# EAGLE design Schematic (EAGLE 7.5.0)
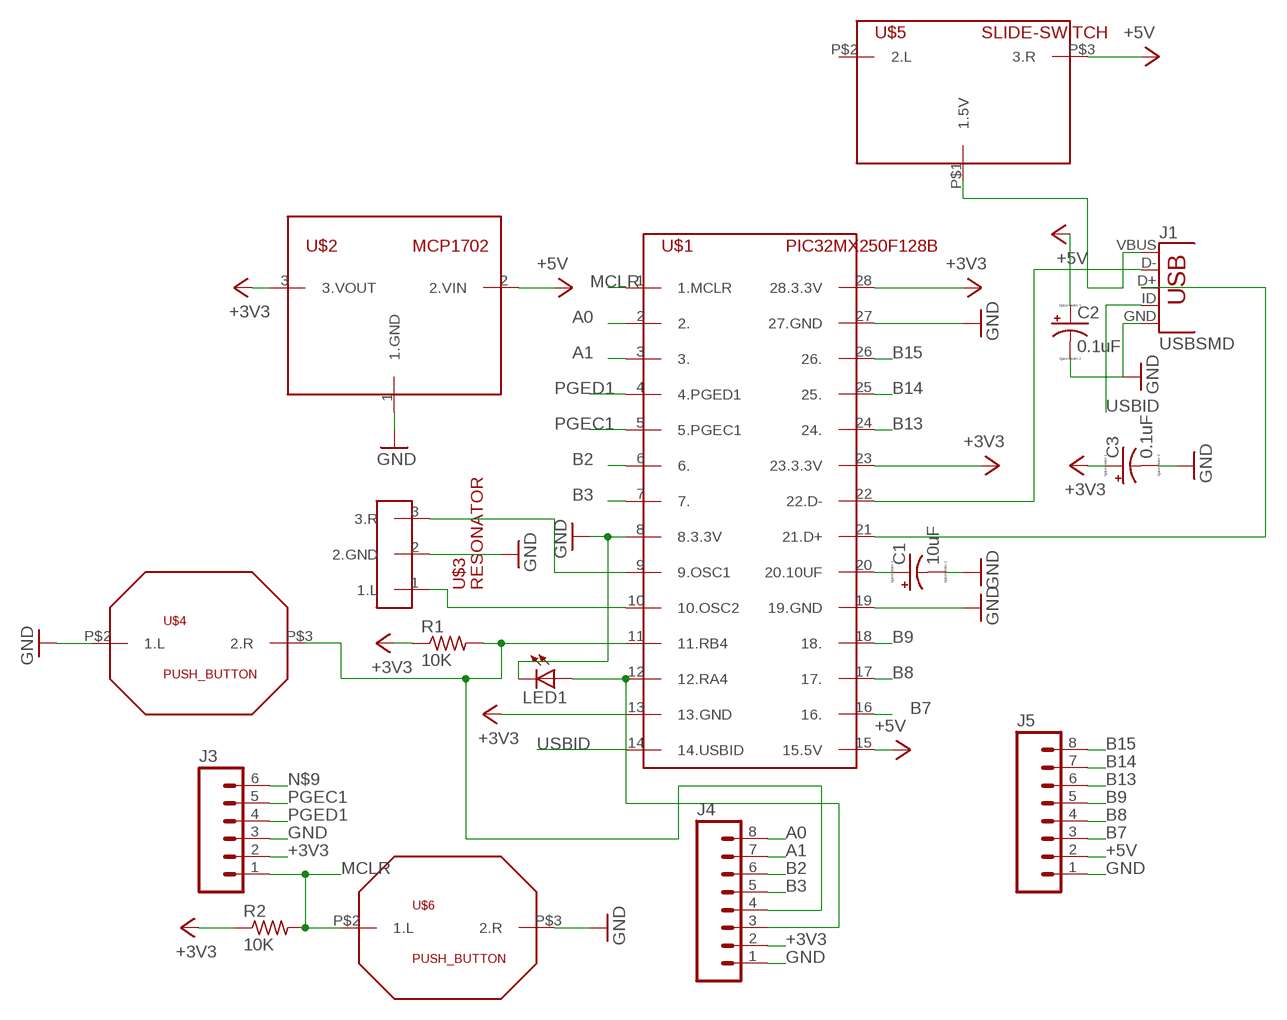
[diagram p0: schematic, sheet 1]

## Parts
C1  10uF  CPOL-USE2.5-5  [E2,5-5]
C2  0.1uF  CPOL-USE2.5-5  [E2,5-5]
C3  0.1uF  CPOL-USE2.5-5  [E2,5-5]
J1  USBSMD  [USB-MINIB]
J3  M06SILK_FEMALE_PTH  [1X06]
J4  M08SILK_FEMALE_PTH  [1X08]
J5  M08SILK_FEMALE_PTH  [1X08]
LED1  LED3MM  [LED3MM]
R1  10K  R-US_0207/10  [0207/10]
R2  10K  R-US_0207/10  [0207/10]
U$1  PIC32MX250F128B  [DIL28-3]
U$2  MCP1702  [TO92]
U$3  RESONATOR  [1X03]
U$4  PUSH_BUTTON  [PUSH_BUTTON]
U$5  SLIDE-SWITCH  [SLIDE-SWITCH]
U$6  PUSH_BUTTON  [PUSH_BUTTON]

## Nets
+3V3: C3.+ J3.2 J4.2 R1.1 R2.1 U$1.13(13.GND) U$1.23(23.3.3V) U$1.28(28.3.3V) U$2.3(3.VOUT)
+5V: C2.+ J5.2 U$1.15(15.5V) U$2.2(2.VIN) U$5.P$3(3.R)
A0: J4.8 U$1.2(2.)
A1: J4.7 U$1.3(3.)
A4: J4.3 LED1.A U$1.12(12.RA4)
B2: J4.6 U$1.6(6.)
B3: J4.5 U$1.7(7.)
B4: J4.4 R1.2 U$1.11(11.RB4) U$4.P$3(2.R)
B7: J5.3 U$1.16(16.)
B8: J5.4 U$1.17(17.)
B9: J5.5 U$1.18(18.)
B13: J5.6 U$1.24(24.)
B14: J5.7 U$1.25(25.)
B15: J5.8 U$1.26(26.)
GND: C1.- C2.- C3.- J1.GND(1.GND) J3.3 J4.1 J5.1 LED1.K(C) U$1.8(8.3.3V) U$1.19(19.GND) U$1.27(27.GND) U$2.1(1.GND) U$3.2(2.GND) U$4.P$2(1.L) U$6.P$3(2.R)
MCLR: J3.1 R2.2 U$1.1(1.MCLR) U$6.P$2(1.L)
N$1: C1.+ U$1.20(20.10UF)
N$2: J1.D-(4.D-) U$1.22(22.D-)
N$3: J1.D+(3.D+) U$1.21(21.D+)
N$4: U$1.9(9.OSC1) U$3.3(3.R)
N$5: U$1.10(10.OSC2) U$3.1(1.L)
N$6: J1.VBUS(5.VBUS) U$5.P$1(1.5V)
N$9: J3.6
PGEC1: J3.5 U$1.5(5.PGEC1)
PGED1: J3.4 U$1.4(4.PGED1)
USBID: J1.ID(2.ID) U$1.14(14.USBID)
Unconnected: U$5.P$2(2.L)

## Library data of the parts
C1-C3 = pic32_library:CPOL-US: POLARIZED CAPACITOR, American symbol
J1 = pic32_library:USB: USB Connectors USB-B-PTH is fully proven SKU : PRT-00139/CONN-08278 USB-miniB is fully proven SKU : PRT-00587 USB-A-PCB is untested. USB-A-H is throughly reviewed, but untested. Spark Fun Electronics SKU : PRT-00437 USB-B-SMT is throughly reviewed, but untested. Needs silkscreen touching up. USB-A-S has not been used/tested USB-MB-H has not been used/tested USB-MICROB has been used. CONN-09505; PROD_ID: CONN-08193
J3 = pic32_library:M06: Header 6 Standard 6-pin 0.1" header. Use with straight break away headers (SKU : PRT-00116), right angle break away headers (PRT-00553), swiss pins (PRT-00743), machine pins (PRT-00117), and female headers (PRT-00115). Molex polarized connector foot print use with SKU : PRT-08094 with associated crimp pins and housings. NOTES ON THE VARIANTS LOCK and LOCK_LONGPADS... This footprint was designed to help hold the alignment of a through-hole component (i.e. 6-pin header) while soldering it into place. You may notice that each hole has been shifted either up or down by 0.005 of an inch from it's more standard position (which is a perfectly straight line). This slight alteration caused the pins (the squares in the middle) to touch the edges of the holes. Because they are alternating, it causes a "brace" to hold the component in place. 0.005 has proven to be the perfect amount of "off-center" position when using our standard breakaway headers. Although looks a little odd when you look at the bare footprint, once you have a header in there, the alteration is very hard to notice. Also,if you push a header all the way into place, it is covered up entirely on the bottom side. This idea of altering the position of holes to aid alignment will be further integrated into the Sparkfun Library for other footprints. It can help hold any component with 3 or more connection pins.; PROD_ID: CONN-08437
J4 J5 = pic32_library:M08: Header 8 Standard 8-pin 0.1" header. Use with straight break away headers (SKU : PRT-00116), right angle break away headers (PRT-00553), swiss pins (PRT-00743), machine pins (PRT-00117), and female headers (PRT-00115).; PROD_ID: CONN-08438
LED1 = pic32_library:LED: LED OSRAM: - CHIPLED LG R971, LG N971, LY N971, LG Q971, LY Q971, LO R971, LY R971 LH N974, LH R974 LS Q976, LO Q976, LY Q976 LO Q996 - Hyper CHIPLED LW Q18S LB Q993, LB Q99A, LB R99A - SideLED LS A670, LO A670, LY A670, LG A670, LP A670 LB A673, LV A673, LT A673, LW A673 LH A674 LY A675 LS A676, LA A676, LO A676, LY A676, LW A676 LS A679, LY A679, LG A679 - Hyper Micro SIDELED® LS Y876, LA Y876, LO Y876, LY Y876 LT Y87S - SmartLED LW L88C, LW L88S LB L89C, LB L89S, LG L890 LS L89K, LO L89K, LY L89K LS L896, LA L896, LO L896, LY L896 - TOPLED LS T670, LO T670, LY T670, LG T670, LP T670 LSG T670, LSP T670, LSY T670, LOP T670, LYG T670 LG T671, LOG T671, LSG T671 LB T673, LV T673, LT T673, LW T673 LH T674 LS T676, LA T676, LO T676, LY T676, LB T676, LH T676, LSB T676, LW T676 LB T67C, LV T67C, LT T67C, LS T67K, LO T67K, LY T67K, LW E67C LS E67B, LA E67B, LO E67B, LY E67B, LB E67C, LV E67C, LT E67C LW T67C LS T679, LY T679, LG T679 LS T770, LO T770, LY T770, LG T770, LP T770 LB T773, LV T773, LT T773, LW T773 LH T774 LS E675, LA E675, LY E675, LS T675 LS T776, LA T776, LO T776, LY T776, LB T776 LHGB T686 LT T68C, LB T68C - Hyper Mini TOPLED® LB M676 - Mini TOPLED Santana® LG M470 LS M47K, LO M47K, LY M47K Source: http://www.osram.convergy.de LUXEON: - LUMILED® LXK2-PW12-R00, LXK2-PW12-S00, LXK2-PW14-U00, LXK2-PW14-V00 LXK2-PM12-R00, LXK2-PM12-S00, LXK2-PM14-U00 LXK2-PE12-Q00, LXK2-PE12-R00, LXK2-PE12-S00, LXK2-PE14-T00, LXK2-PE14-U00 LXK2-PB12-K00, LXK2-PB12-L00, LXK2-PB12-M00, LXK2-PB14-N00, LXK2-PB14-P00, LXK2-PB14-Q00 LXK2-PR12-L00, LXK2-PR12-M00, LXK2-PR14-Q00, LXK2-PR14-R00 LXK2-PD12-Q00, LXK2-PD12-R00, LXK2-PD12-S00 LXK2-PH12-R00, LXK2-PH12-S00 LXK2-PL12-P00, LXK2-PL12-Q00, LXK2-PL12-R00 Source: www.luxeon.com KINGBRIGHT: KA-3528ASYC Source: www.kingbright.com
R1 R2 = pic32_library:R-US_: RESISTOR, American symbol
U$1 = pic32_library:PIC32MX250F128B
U$2 = pic32_library:MCP1702
U$3 = pic32_library:RESONATOR
U$4 U$6 = pic32_library:PUSH_BUTTON
U$5 = pic32_library:SLIDE-SWITCH

## Board
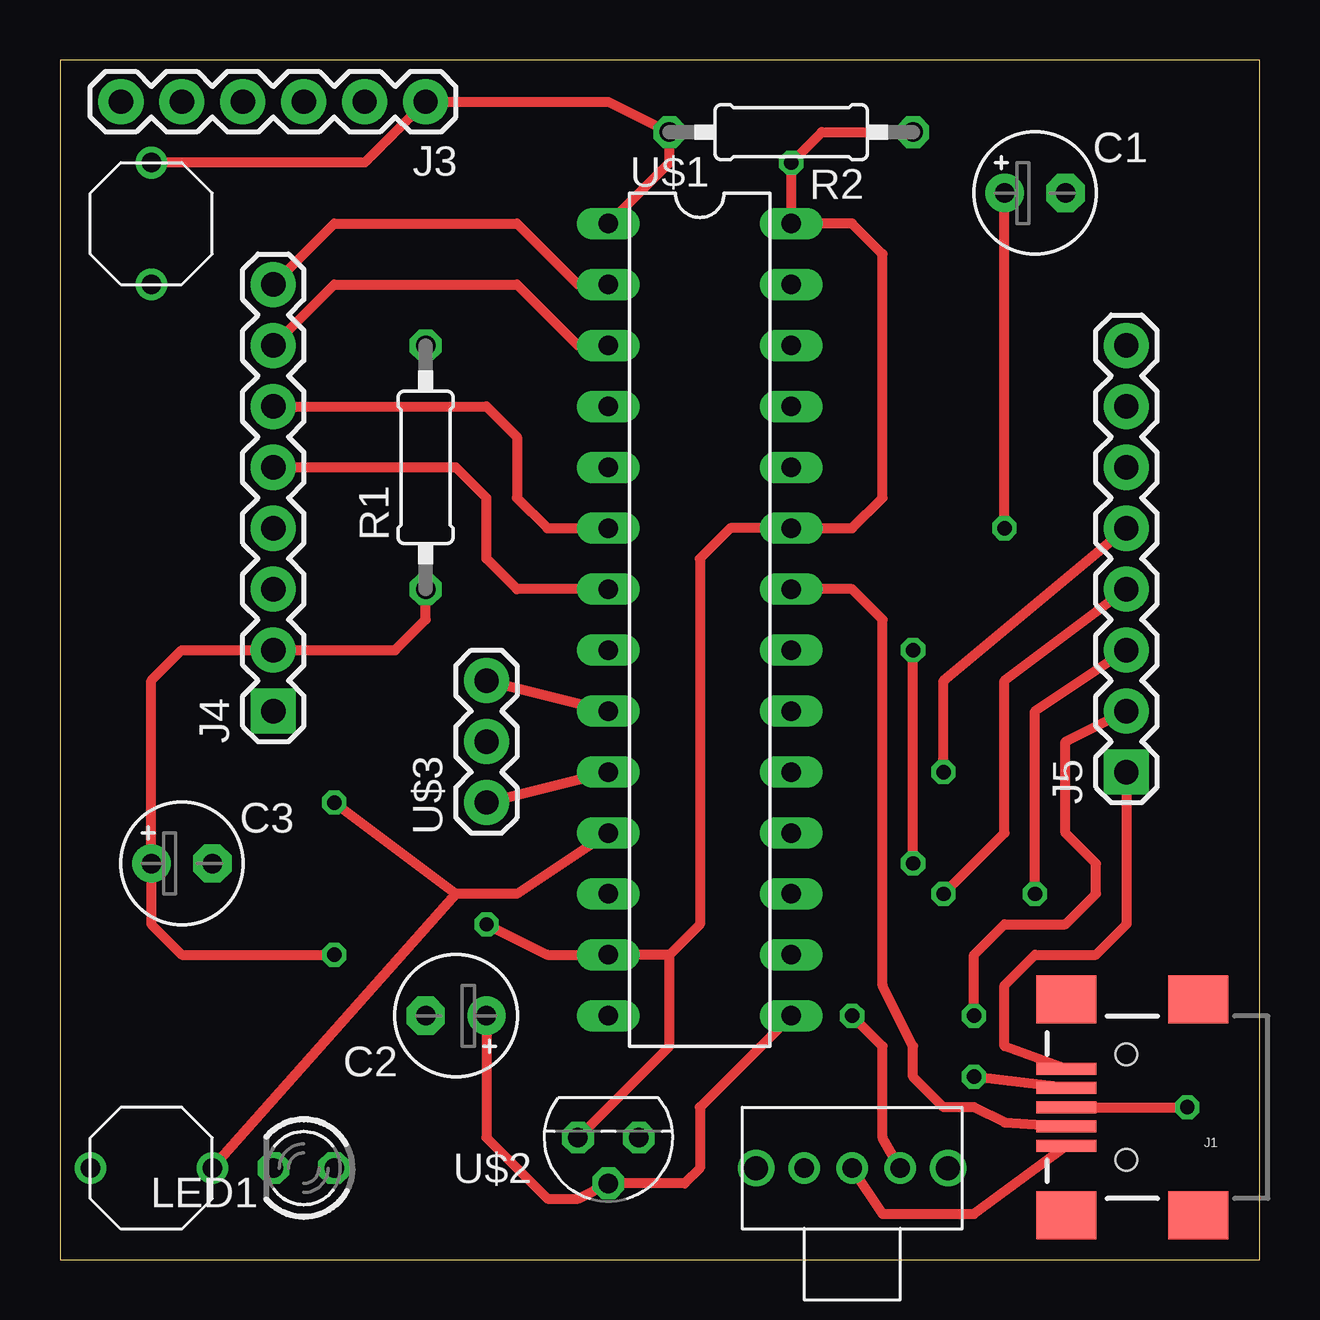
[diagram p1: board, top side]
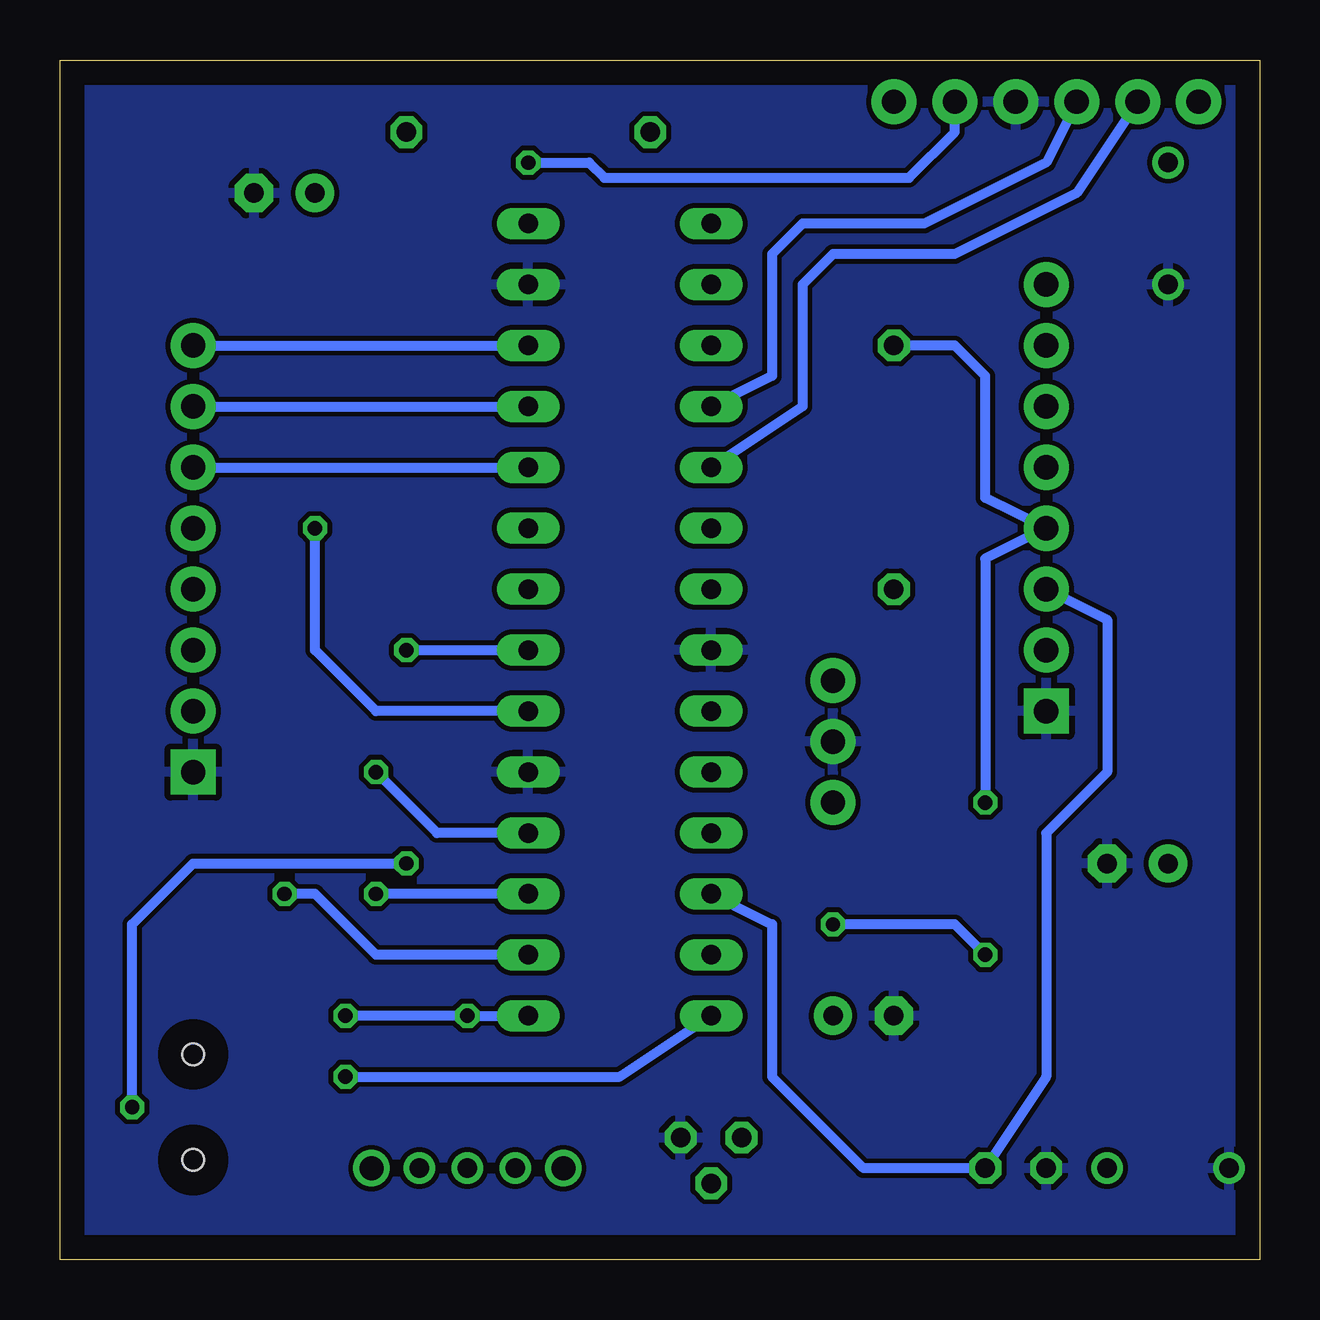
[diagram p2: board, bottom side, seen from below]

Size 50 x 50 mm. Coordinates in mm from the lower left corner, seen from the top.
Outline: 0,0 50,0 50,50 0,50 0,0
Copper layers (1*16): Top 0.035mm / dielectric 1.5mm / Bottom 0.035mm
Design rules "default": minimum track width 10mil, minimum drill 24mil, track to track 8mil, track to pad 8mil, pad to pad 8mil, via to via 8mil, smd to smd 8mil, copper to edge 40mil, drill to drill 8mil, minimum pad ring 10mil, minimum via ring 8mil, stop-mask expansion 4mil, vias tented up to drill 0mil, thermal gap 10mil

### Footprints (pad centres in the part's own frame; a part is rotated, then mirrored left to right if it is on the bottom)
E2,5-5 = drill 0.813 pad 1.6: + -1.27,0 | drill 0.813 pad 1.6 octagon: - 1.27,0
USB-MINIB = smd 2.5 x 0.5: D+ 2.5,0; D- 2.5,0.8; GND 2.5,-1.6; ID 2.5,-0.8; VBUS 2.5,1.6 | smd 2.5 x 2: MTN1 -3,4.5; MTN2 2.5,4.5; MTN3 -3,-4.5; MTN4 2.5,-4.5 | hole 0.9: 0,2.2; 0,-2.2
1X06 = drill 1.016 pad 1.88: 1 0,0; 2 2.54,0; 3 5.08,0; 4 7.62,0; 5 10.16,0; 6 12.7,0
1X08 = drill 1.016 pad 1.88 square: 1 0,0 | drill 1.016 pad 1.88: 2 2.54,0; 3 5.08,0; 4 7.62,0; 5 10.16,0; 6 12.7,0; 7 15.24,0; 8 17.78,0
LED3MM = drill 0.813 octagon: A -1.27,0; K 1.27,0
0207/10 = drill 0.813 octagon: 1 -5.08,0; 2 5.08,0
DIL28-3 = drill 0.813 long: 1 -16.51,-3.81; 2 -13.97,-3.81; 3 -11.43,-3.81; 4 -8.89,-3.81; 5 -6.35,-3.81; 6 -3.81,-3.81; 7 -1.27,-3.81; 8 1.27,-3.81; 9 3.81,-3.81; 10 6.35,-3.81; 11 8.89,-3.81; 12 11.43,-3.81; 13 13.97,-3.81; 14 16.51,-3.81; 15 16.51,3.81; 16 13.97,3.81; 17 11.43,3.81; 18 8.89,3.81; 19 6.35,3.81; 20 3.81,3.81; 21 1.27,3.81; 22 -1.27,3.81; 23 -3.81,3.81; 24 -6.35,3.81; 25 -8.89,3.81; 26 -11.43,3.81; 27 -13.97,3.81; 28 -16.51,3.81
TO92 = drill 0.813 octagon: 1 -1.27,0; 2 0,1.905; 3 1.27,0
1X03 = drill 1.016 pad 1.88: 1 0,0; 2 2.54,0; 3 5.08,0
PUSH_BUTTON = drill 0.813: P$2 2.54,0; P$3 -2.54,0
SLIDE-SWITCH = drill 0.8: P$1 0,0; P$2 -2,0; P$3 2,0 | drill 1: P$4 -4,0; P$5 4,0

### Placement (x,y rotation side)
C1  40.64,44.45 0 top
C2  16.51,10.16 180 top
C3  5.08,16.51 0 top
J1  44.45,6.35 180 top
J3  15.24,48.26 180 top
J4  8.89,22.86 90 top
J5  44.45,20.32 90 top
LED1  10.16,3.81 180 top
R1  15.24,33.02 90 top
R2  30.48,46.99 180 top
U$1  26.67,26.67 270 top
U$2  22.86,5.08 180 top
U$3  17.78,19.05 90 top
U$4  3.81,3.81 180 top
U$5  33.02,3.81 0 top
U$6  3.81,43.18 90 top

### Tracks (layer width: path | path; a pad name or v marks a point on that pad's centre or on a via)
+3V3  (via drill 0.6)
  Top 0.406: 25.4,12.7 26.67,13.97 26.67,29.21 27.94,30.48 U$1.23 33.02,30.48 34.29,31.75 34.29,41.91 33.02,43.18 U$1.28 v30.48,45.72 31.75,46.99 R2.1 | 25.4,12.7 U$1.13 20.32,12.7 v17.78,13.97 | U$2.3 25.4,8.89 25.4,12.7 | v11.43,12.7 5.08,12.7 3.81,13.97 C3.+ 3.81,24.13 5.08,25.4 J4.2 13.97,25.4 15.24,26.67 R1.1
  Bottom 0.406: v30.48,45.72 27.94,45.72 27.3,45.09 14.61,45.09 12.7,46.99 J3.2 | v11.43,12.7 12.7,13.97 v17.78,13.97
+5V  (via drill 0.6)
  Top 0.406: U$5.P$3 34.29,5.08 34.29,8.89 v33.02,10.16 | v38.1,10.16 38.1,12.7 39.37,13.97 41.91,13.97 43.18,15.24 43.18,16.51 41.91,17.78 41.91,21.59 J5.2 | U$1.15 26.67,6.35 26.67,3.81 26.04,3.17 U$2.2 21.59,2.54 20.32,2.54 17.78,5.08 C2.+
  Bottom 0.406: U$1.15 v33.02,10.16 v38.1,10.16
A0
  Top 0.406: J4.8 11.43,43.18 19.05,43.18 21.59,40.64 U$1.2
A1
  Top 0.406: J4.7 11.43,40.64 19.05,40.64 21.59,38.1 U$1.3
A4
  Bottom 0.406: U$1.12 20.32,13.97 20.32,7.62 16.51,3.81 LED1.A 8.89,7.62 8.89,17.78 6.35,20.32 6.35,26.67 J4.3
B2
  Top 0.406: J4.6 17.78,35.56 19.05,34.29 19.05,31.75 20.32,30.48 U$1.6
B3
  Top 0.406: U$1.7 19.05,27.94 17.78,29.21 17.78,31.75 16.51,33.02 J4.5
B4  (via drill 0.6)
  Top 0.406: U$1.11 19.05,15.24 16.51,15.24 | 16.51,15.24 U$4.P$3 | v11.43,19.05 16.51,15.24
  Bottom 0.406: R1.2 12.7,38.1 11.43,36.83 11.43,31.75 J4.4 11.43,29.21 v11.43,19.05
B7  (via drill 0.6)
  Top 0.406: v40.64,15.24 40.64,22.86 J5.3
  Bottom 0.406: U$1.16 36.83,12.7 39.37,15.24 v40.64,15.24
B8  (via drill 0.6)
  Top 0.406: v36.83,15.24 39.37,17.78 39.37,24.13 J5.4
  Bottom 0.406: U$1.17 v36.83,15.24
B9  (via drill 0.6)
  Top 0.406: v36.83,20.32 36.83,24.13 J5.5
  Bottom 0.406: U$1.18 34.29,17.78 v36.83,20.32
B13
  Bottom 0.406: J5.6 U$1.24
B14
  Bottom 0.406: J5.7 U$1.25
B15
  Bottom 0.406: J5.8 U$1.26
GND
  Top 0.406: J5.1 44.45,13.97 43.18,12.7 40.64,12.7 39.37,11.43 39.37,8.89 J1.GND
  pour Bottom: 0,49.53 0,0 49.53,0 49.53,49.53
MCLR
  Top 0.406: U$1.1 25.4,45.72 R2.2 22.86,48.26 J3.1 12.7,45.72 U$6.P$2
N$1  (via drill 0.6)
  Top 0.406: v39.37,30.48 C1.+
  Bottom 0.406: U$1.20 36.83,22.86 39.37,25.4 v39.37,30.48
N$2
  Top 0.406: U$1.22 33.02,27.94 34.29,26.67 34.29,11.43 35.56,8.89 35.56,7.62 36.83,6.35 38.1,6.35 39.37,5.71 J1.D-
N$3  (via drill 0.6)
  Top 0.406: J1.D+ v46.99,6.35 | v35.56,16.51 v35.56,25.4
  Bottom 0.406: v46.99,6.35 46.99,13.97 44.45,16.51 v35.56,16.51 | v35.56,25.4 U$1.21
N$4
  Top 0.406: U$3.3 U$1.9
N$5
  Top 0.406: U$3.1 U$1.10
N$6
  Top 0.406: U$5.P$1 34.29,1.91 38.1,1.91 J1.VBUS
PGEC1
  Bottom 0.406: J3.5 7.62,44.45 12.7,41.91 17.78,41.91 19.05,40.64 19.05,35.56 U$1.5
PGED1
  Bottom 0.406: J3.4 8.89,45.72 13.97,43.18 19.05,43.18 20.32,41.91 20.32,36.83 U$1.4
USBID  (via drill 0.6)
  Top 0.406: J1.ID v38.1,7.62
  Bottom 0.406: v38.1,7.62 26.67,7.62 U$1.14